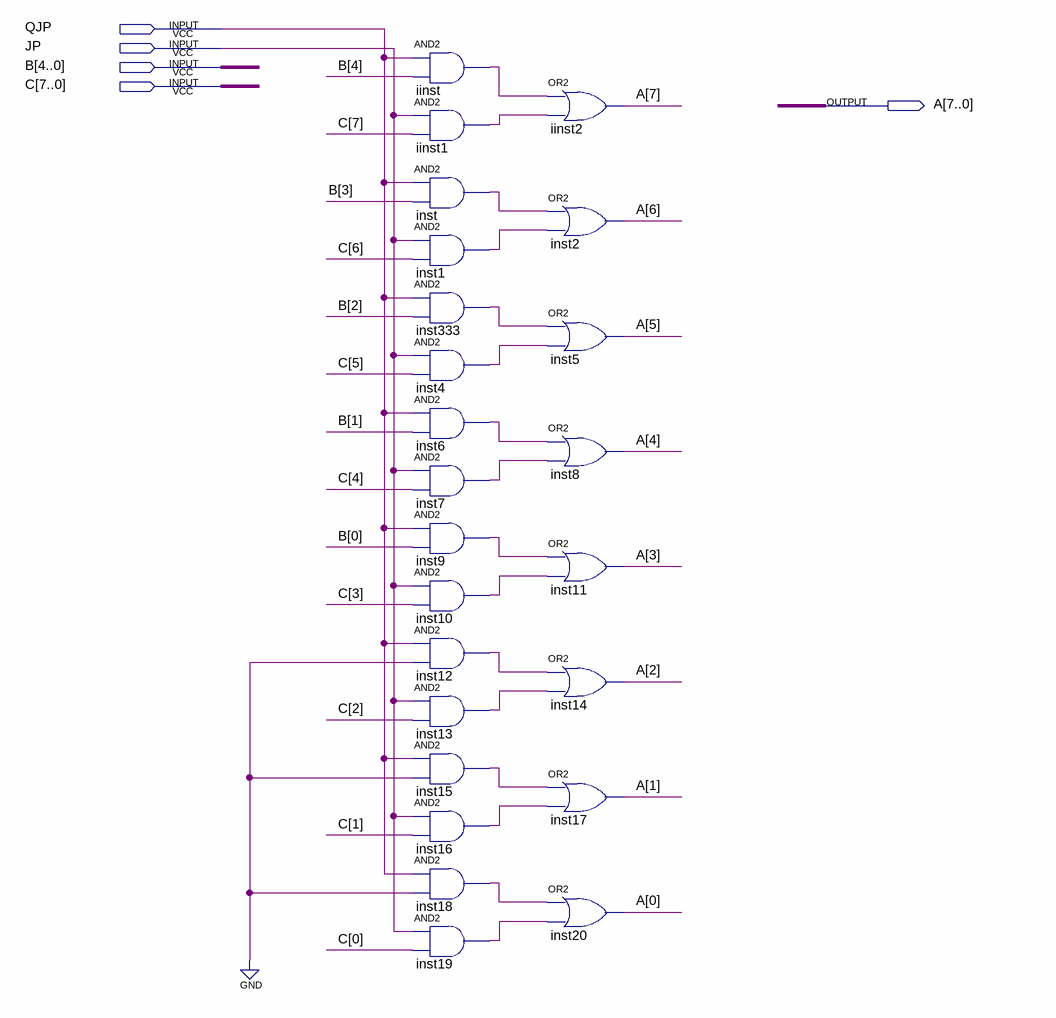
[diagram p0: schematic sheet]
// Quartus schematic Data_Selector.bdf as structural Verilog: 24 symbols, 5 pins
module Data_Selector (
  input  QJP,
  input  JP,
  input  [4:0] B,
  input  [7:0] C,
  output [7:0] A
);

  wire iinst1_out, iinst_out, inst1_out, inst4_out, inst6_out, inst7_out, inst9_out, inst10_out, inst12_out,
       inst13_out, inst15_out, inst16_out, inst18_out, inst19_out, inst333_out, inst_out;

  and iinst (iinst_out, QJP, B[4]);
  and iinst1 (iinst1_out, JP, C[7]);
  and inst (inst_out, QJP, B[3]);
  and inst1 (inst1_out, JP, C[6]);
  and inst333 (inst333_out, QJP, B[2]);
  and inst4 (inst4_out, JP, C[5]);
  and inst6 (inst6_out, QJP, B[1]);
  and inst7 (inst7_out, JP, C[4]);
  and inst9 (inst9_out, QJP, B[0]);
  and inst10 (inst10_out, JP, C[3]);
  and inst12 (inst12_out, QJP, 1'b0);
  and inst13 (inst13_out, JP, C[2]);
  and inst15 (inst15_out, QJP, 1'b0);
  and inst16 (inst16_out, JP, C[1]);
  and inst18 (inst18_out, QJP, 1'b0);
  and inst19 (inst19_out, JP, C[0]);
  or iinst2 (A[7], iinst_out, iinst1_out);
  or inst2 (A[6], inst_out, inst1_out);
  or inst5 (A[5], inst333_out, inst4_out);
  or inst8 (A[4], inst6_out, inst7_out);
  or inst11 (A[3], inst9_out, inst10_out);
  or inst14 (A[2], inst12_out, inst13_out);
  or inst17 (A[1], inst15_out, inst16_out);
  or inst20 (A[0], inst18_out, inst19_out);
endmodule
